# EAGLE schematic homecontroller_main (EAGLE 6.5.0)

## Sheet 1 of 5
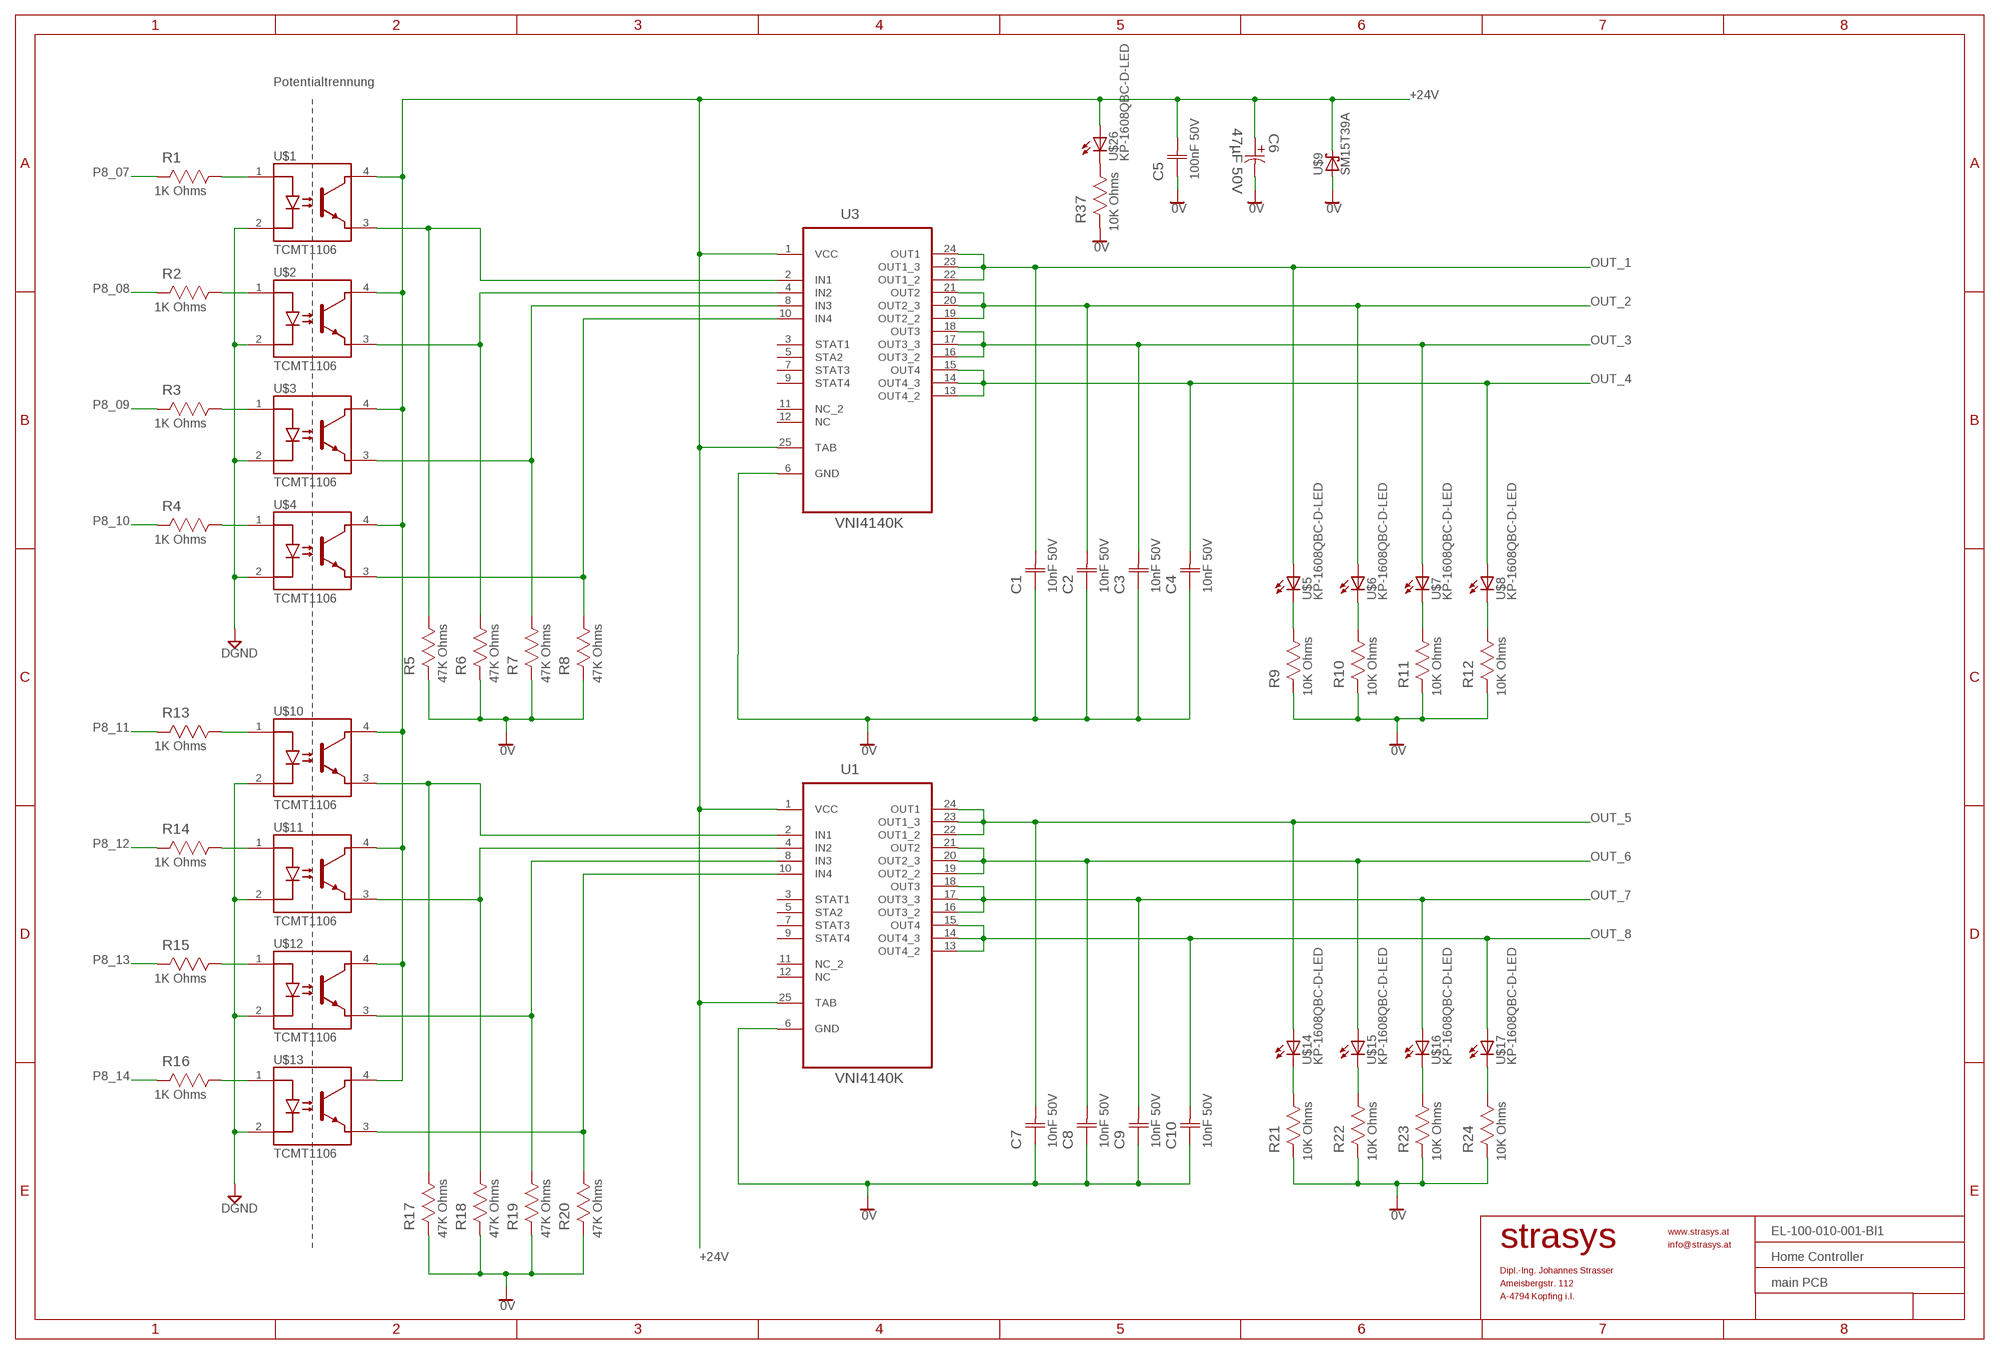
[diagram p0: schematic, sheet 1]

### Parts
C1  10nF 50V  C0603C103K5RACTU  [CAPC1608X85N]
C2  10nF 50V  C0603C103K5RACTU  [CAPC1608X85N]
C3  10nF 50V  C0603C103K5RACTU  [CAPC1608X85N]
C4  10nF 50V  C0603C103K5RACTU  [CAPC1608X85N]
C5  100nF 50V  C0603C104K4RACTU  [CAPC1608X85N]
C6  47µF 50V  EEE-FK1H470P-CASE-E  [CAPAE830X650N]
C7  10nF 50V  C0603C103K5RACTU  [CAPC1608X85N]
C8  10nF 50V  C0603C103K5RACTU  [CAPC1608X85N]
C9  10nF 50V  C0603C103K5RACTU  [CAPC1608X85N]
C10  10nF 50V  C0603C103K5RACTU  [CAPC1608X85N]
R1  1K Ohms  CRCW06031K00FKEA  [RESC1608X60N]
R2  1K Ohms  CRCW06031K00FKEA  [RESC1608X60N]
R3  1K Ohms  CRCW06031K00FKEA  [RESC1608X60N]
R4  1K Ohms  CRCW06031K00FKEA  [RESC1608X60N]
R5  47K Ohms  CRCW060347K0FKEA  [RESC1608X60N]
R6  47K Ohms  CRCW060347K0FKEA  [RESC1608X60N]
R7  47K Ohms  CRCW060347K0FKEA  [RESC1608X60N]
R8  47K Ohms  CRCW060347K0FKEA  [RESC1608X60N]
R9  10K Ohms  CRCW060310K0FKEA  [RESC1608X60N]
R10  10K Ohms  CRCW060310K0FKEA  [RESC1608X60N]
R11  10K Ohms  CRCW060310K0FKEA  [RESC1608X60N]
R12  10K Ohms  CRCW060310K0FKEA  [RESC1608X60N]
R13  1K Ohms  CRCW06031K00FKEA  [RESC1608X60N]
R14  1K Ohms  CRCW06031K00FKEA  [RESC1608X60N]
R15  1K Ohms  CRCW06031K00FKEA  [RESC1608X60N]
R16  1K Ohms  CRCW06031K00FKEA  [RESC1608X60N]
R17  47K Ohms  CRCW060347K0FKEA  [RESC1608X60N]
R18  47K Ohms  CRCW060347K0FKEA  [RESC1608X60N]
R19  47K Ohms  CRCW060347K0FKEA  [RESC1608X60N]
R20  47K Ohms  CRCW060347K0FKEA  [RESC1608X60N]
R21  10K Ohms  CRCW060310K0FKEA  [RESC1608X60N]
R22  10K Ohms  CRCW060310K0FKEA  [RESC1608X60N]
R23  10K Ohms  CRCW060310K0FKEA  [RESC1608X60N]
R24  10K Ohms  CRCW060310K0FKEA  [RESC1608X60N]
R37  10K Ohms  CRCW060310K0FKEA  [RESC1608X60N]
U1  VNI4140K  [SOP80P1030X247-25N]
U3  VNI4140K  [SOP80P1030X247-25N]
U$1  TCMT1106  [SOP-4]
U$2  TCMT1106  [SOP-4]
U$3  TCMT1106  [SOP-4]
U$4  TCMT1106  [SOP-4]
U$5  KP-1608QBC-D-LED  [KP-1608QBCD-D-LED]
U$6  KP-1608QBC-D-LED  [KP-1608QBCD-D-LED]
U$7  KP-1608QBC-D-LED  [KP-1608QBCD-D-LED]
U$8  KP-1608QBC-D-LED  [KP-1608QBCD-D-LED]
U$9  SM15T39A  [SM15T39A]
U$10  TCMT1106  [SOP-4]
U$11  TCMT1106  [SOP-4]
U$12  TCMT1106  [SOP-4]
U$13  TCMT1106  [SOP-4]
U$14  KP-1608QBC-D-LED  [KP-1608QBCD-D-LED]
U$15  KP-1608QBC-D-LED  [KP-1608QBCD-D-LED]
U$16  KP-1608QBC-D-LED  [KP-1608QBCD-D-LED]
U$17  KP-1608QBC-D-LED  [KP-1608QBCD-D-LED]
U$26  KP-1608QBC-D-LED  [KP-1608QBCD-D-LED]

### Nets
0V: C1.1(C1) C2.1(C1) C3.1(C1) C4.1(C1) C5.1(C1) C6.2 C7.1(C1) C8.1(C1) C9.1(C1) C10.1(C1) R5.2 R6.2 R7.2 R8.2 R9.2 R10.2 R11.2 R12.2 R17.2 R18.2 R19.2 R20.2 R21.2 R22.2 R23.2 R24.2 R37.2 U1.6(GND) U3.6(GND) U$9.A ; also sheet 2,5
+24V: C5.2(C2) C6.1 U1.1(VCC) U1.25(TAB) U3.1(VCC) U3.25(TAB) U$1.4 U$2.4 U$3.4 U$4.4 U$9.K(C) U$10.4 U$11.4 U$12.4 U$13.4 U$26.1 ; also sheet 2,5
DGND: U$1.2 U$2.2 U$3.2 U$4.2 U$10.2 U$11.2 U$12.2 U$13.2 ; also sheet 2,3,5
N$1: R1.1 U$1.1
N$2: R2.1 U$2.1
N$3: R3.1 U$3.1
N$4: R4.1 U$4.1
N$5: R5.1 U3.2(IN1) U$1.3
N$6: R6.1 U3.4(IN2) U$2.3
N$7: R7.1 U3.8(IN3) U$3.3
N$8: R8.1 U3.10(IN4) U$4.3
N$9: R13.1 U$10.1
N$10: R9.1 U$5.2
N$11: R10.1 U$6.2
N$12: R11.1 U$7.2
N$13: R12.1 U$8.2
N$14: R14.1 U$11.1
N$15: R15.1 U$12.1
N$16: R16.1 U$13.1
N$17: R17.1 U1.2(IN1) U$10.3
N$18: R18.1 U1.4(IN2) U$11.3
N$19: R19.1 U1.8(IN3) U$12.3
N$20: R20.1 U1.10(IN4) U$13.3
N$21: R21.1 U$14.2
N$22: R22.1 U$15.2
N$23: R23.1 U$16.2
N$24: R24.1 U$17.2
N$37: R37.1 U$26.2
OUT_1: C1.2(C2) U3.22(OUT1_2) U3.23(OUT1_3) U3.24(OUT1) U$5.1 ; also sheet 5
OUT_2: C2.2(C2) U3.19(OUT2_2) U3.20(OUT2_3) U3.21(OUT2) U$6.1 ; also sheet 5
OUT_3: C3.2(C2) U3.16(OUT3_2) U3.17(OUT3_3) U3.18(OUT3) U$7.1 ; also sheet 5
OUT_4: C4.2(C2) U3.13(OUT4_2) U3.14(OUT4_3) U3.15(OUT4) U$8.1 ; also sheet 5
OUT_5: C7.2(C2) U1.22(OUT1_2) U1.23(OUT1_3) U1.24(OUT1) U$14.1 ; also sheet 5
OUT_6: C8.2(C2) U1.19(OUT2_2) U1.20(OUT2_3) U1.21(OUT2) U$15.1 ; also sheet 5
OUT_7: C9.2(C2) U1.16(OUT3_2) U1.17(OUT3_3) U1.18(OUT3) U$16.1 ; also sheet 5
OUT_8: C10.2(C2) U1.13(OUT4_2) U1.14(OUT4_3) U1.15(OUT4) U$17.1 ; also sheet 5
P8_07: R1.2 ; also sheet 5
P8_08: R2.2 ; also sheet 5
P8_09: R3.2 ; also sheet 5
P8_10: R4.2 ; also sheet 5
P8_11: R13.2 ; also sheet 5
P8_12: R14.2 ; also sheet 5
P8_13: R15.2 ; also sheet 5
P8_14: R16.2 ; also sheet 5
Unconnected: U1.3(STAT1) U1.5(STA2) U1.7(STAT3) U1.9(STAT4) U1.11(NC_2) U1.12(NC) U3.3(STAT1) U3.5(STA2) U3.7(STAT3) U3.9(STAT4) U3.11(NC_2) U3.12(NC)

### Notes on the sheet
- Potentialtrennung
- EL-100-010-001-Bl1
- Home Controller
- main PCB

## Sheet 2 of 5
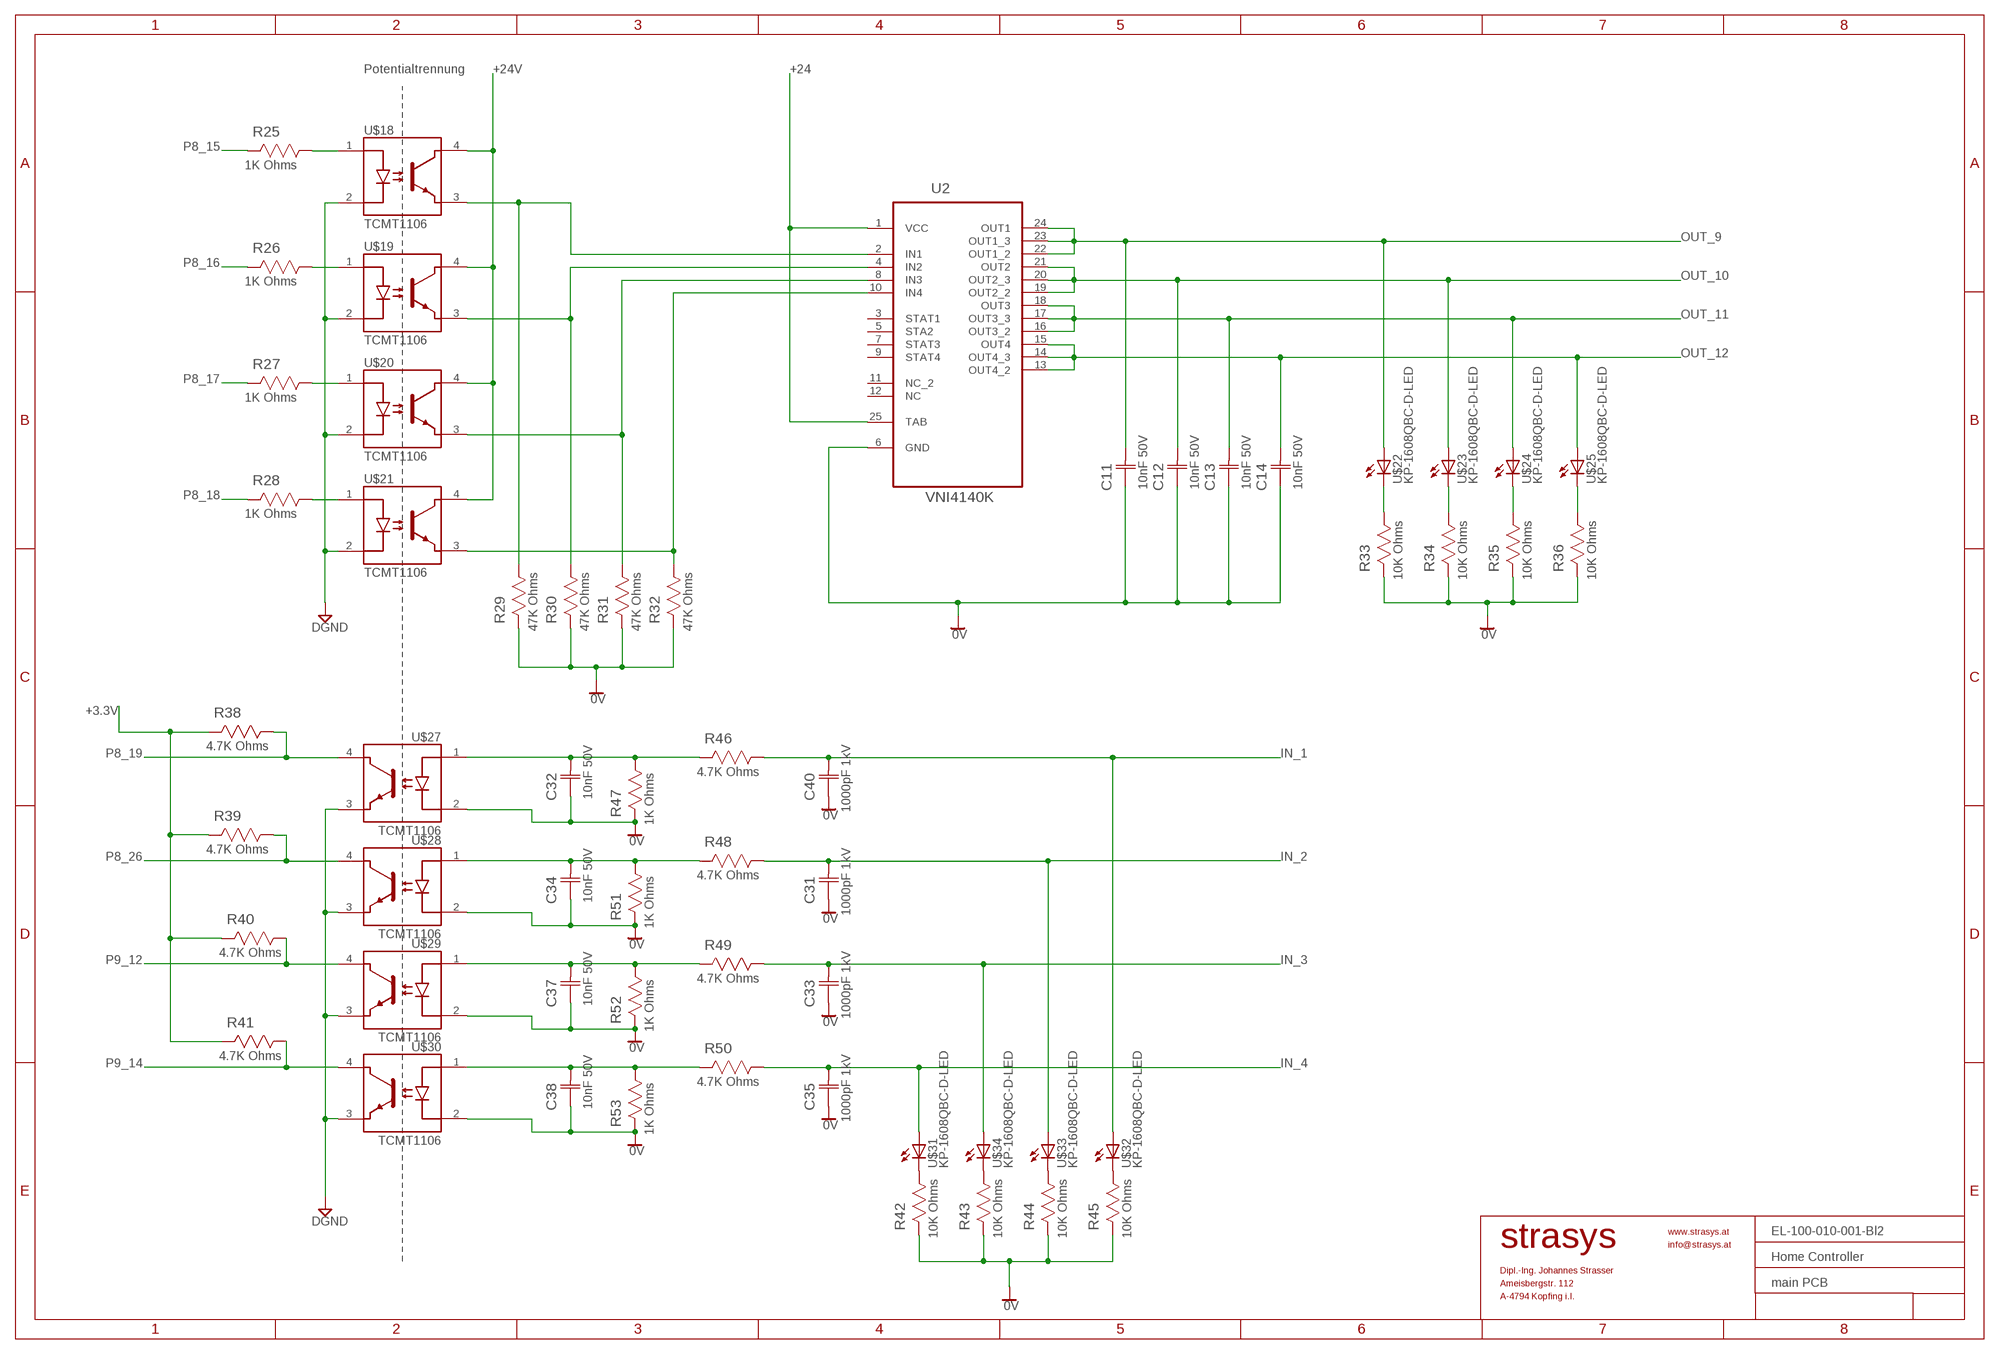
[diagram p1: schematic, sheet 2]

### Parts
C11  10nF 50V  C0603C103K5RACTU  [CAPC1608X85N]
C12  10nF 50V  C0603C103K5RACTU  [CAPC1608X85N]
C13  10nF 50V  C0603C103K5RACTU  [CAPC1608X85N]
C14  10nF 50V  C0603C103K5RACTU  [CAPC1608X85N]
C31  1000pF 1kV  C1206C102KDRACTU  [CAPC3216X88N]
C32  10nF 50V  C0603C103K5RACTU  [CAPC1608X85N]
C33  1000pF 1kV  C1206C102KDRACTU  [CAPC3216X88N]
C34  10nF 50V  C0603C103K5RACTU  [CAPC1608X85N]
C35  1000pF 1kV  C1206C102KDRACTU  [CAPC3216X88N]
C37  10nF 50V  C0603C103K5RACTU  [CAPC1608X85N]
C38  10nF 50V  C0603C103K5RACTU  [CAPC1608X85N]
C40  1000pF 1kV  C1206C102KDRACTU  [CAPC3216X88N]
R25  1K Ohms  CRCW06031K00FKEA  [RESC1608X60N]
R26  1K Ohms  CRCW06031K00FKEA  [RESC1608X60N]
R27  1K Ohms  CRCW06031K00FKEA  [RESC1608X60N]
R28  1K Ohms  CRCW06031K00FKEA  [RESC1608X60N]
R29  47K Ohms  CRCW060347K0FKEA  [RESC1608X60N]
R30  47K Ohms  CRCW060347K0FKEA  [RESC1608X60N]
R31  47K Ohms  CRCW060347K0FKEA  [RESC1608X60N]
R32  47K Ohms  CRCW060347K0FKEA  [RESC1608X60N]
R33  10K Ohms  CRCW060310K0FKEA  [RESC1608X60N]
R34  10K Ohms  CRCW060310K0FKEA  [RESC1608X60N]
R35  10K Ohms  CRCW060310K0FKEA  [RESC1608X60N]
R36  10K Ohms  CRCW060310K0FKEA  [RESC1608X60N]
R38  4.7K Ohms  CRCW06034K70FKEA  [RESC1608X60N]
R39  4.7K Ohms  CRCW06034K70FKEA  [RESC1608X60N]
R40  4.7K Ohms  CRCW06034K70FKEA  [RESC1608X60N]
R41  4.7K Ohms  CRCW06034K70FKEA  [RESC1608X60N]
R42  10K Ohms  CRCW060310K0FKEA  [RESC1608X60N]
R43  10K Ohms  CRCW060310K0FKEA  [RESC1608X60N]
R44  10K Ohms  CRCW060310K0FKEA  [RESC1608X60N]
R45  10K Ohms  CRCW060310K0FKEA  [RESC1608X60N]
R46  4.7K Ohms  CRCW06034K70FKEA  [RESC1608X60N]
R47  1K Ohms  CRCW06031K00FKEA  [RESC1608X60N]
R48  4.7K Ohms  CRCW06034K70FKEA  [RESC1608X60N]
R49  4.7K Ohms  CRCW06034K70FKEA  [RESC1608X60N]
R50  4.7K Ohms  CRCW06034K70FKEA  [RESC1608X60N]
R51  1K Ohms  CRCW06031K00FKEA  [RESC1608X60N]
R52  1K Ohms  CRCW06031K00FKEA  [RESC1608X60N]
R53  1K Ohms  CRCW06031K00FKEA  [RESC1608X60N]
U2  VNI4140K  [SOP80P1030X247-25N]
U$18  TCMT1106  [SOP-4]
U$19  TCMT1106  [SOP-4]
U$20  TCMT1106  [SOP-4]
U$21  TCMT1106  [SOP-4]
U$22  KP-1608QBC-D-LED  [KP-1608QBCD-D-LED]
U$23  KP-1608QBC-D-LED  [KP-1608QBCD-D-LED]
U$24  KP-1608QBC-D-LED  [KP-1608QBCD-D-LED]
U$25  KP-1608QBC-D-LED  [KP-1608QBCD-D-LED]
U$27  TCMT1106  [SOP-4]
U$28  TCMT1106  [SOP-4]
U$29  TCMT1106  [SOP-4]
U$30  TCMT1106  [SOP-4]
U$31  KP-1608QBC-D-LED  [KP-1608QBCD-D-LED]
U$32  KP-1608QBC-D-LED  [KP-1608QBCD-D-LED]
U$33  KP-1608QBC-D-LED  [KP-1608QBCD-D-LED]
U$34  KP-1608QBC-D-LED  [KP-1608QBCD-D-LED]

### Nets
0V: C11.1(C1) C12.1(C1) C13.1(C1) C14.1(C1) C31.1(C1) C32.1(C1) C33.1(C1) C34.1(C1) C35.1(C1) C37.1(C1) C38.1(C1) C40.1(C1) R29.2 R30.2 R31.2 R32.2 R33.2 R34.2 R35.2 R36.2 R42.2 R43.2 R44.2 R45.2 R47.2 R51.2 R52.2 R53.2 U2.6(GND) U$27.2 U$28.2 U$29.2 U$30.2 ; also sheet 1,5
+3.3V: R38.2 R39.2 R40.2 R41.2 ; also sheet 3,5
+24: U2.1(VCC) U2.25(TAB)
+24V: U$18.4 U$19.4 U$20.4 U$21.4 ; also sheet 1,5
DGND: U$18.2 U$19.2 U$20.2 U$21.2 U$27.3 U$28.3 U$29.3 U$30.3 ; also sheet 1,3,5
IN_1: C40.2(C2) R46.1 U$32.1 ; also sheet 5
IN_2: C31.2(C2) R48.1 U$33.1 ; also sheet 5
IN_3: C33.2(C2) R49.1 U$34.1 ; also sheet 5
IN_4: C35.2(C2) R50.1 U$31.1 ; also sheet 5
N$25: R25.1 U$18.1
N$26: R26.1 U$19.1
N$27: R27.1 U$20.1
N$28: R28.1 U$21.1
N$29: R29.1 U2.2(IN1) U$18.3
N$30: R30.1 U2.4(IN2) U$19.3
N$31: R31.1 U2.8(IN3) U$20.3
N$32: R32.1 U2.10(IN4) U$21.3
N$33: R33.1 U$22.2
N$34: R34.1 U$23.2
N$35: R35.1 U$24.2
N$36: R36.1 U$25.2
N$38: R42.1 U$31.2
N$39: R43.1 U$34.2
N$40: R44.1 U$33.2
N$41: R45.1 U$32.2
N$42: C32.2(C2) R46.2 R47.1 U$27.1
N$49: C34.2(C2) R48.2 R51.1 U$28.1
N$50: C37.2(C2) R49.2 R52.1 U$29.1
N$51: C38.2(C2) R50.2 R53.1 U$30.1
OUT_9: C11.2(C2) U2.22(OUT1_2) U2.23(OUT1_3) U2.24(OUT1) U$22.1 ; also sheet 5
OUT_10: C12.2(C2) U2.19(OUT2_2) U2.20(OUT2_3) U2.21(OUT2) U$23.1 ; also sheet 5
OUT_11: C13.2(C2) U2.16(OUT3_2) U2.17(OUT3_3) U2.18(OUT3) U$24.1 ; also sheet 5
OUT_12: C14.2(C2) U2.13(OUT4_2) U2.14(OUT4_3) U2.15(OUT4) U$25.1 ; also sheet 5
P8_15: R25.2 ; also sheet 5
P8_16: R26.2 ; also sheet 5
P8_17: R27.2 ; also sheet 5
P8_18: R28.2 ; also sheet 5
P8_19: R38.1 U$27.4 ; also sheet 5
P8_26: R39.1 U$28.4 ; also sheet 5
P9_12: R40.1 U$29.4 ; also sheet 5
P9_14: R41.1 U$30.4 ; also sheet 5
Unconnected: U2.3(STAT1) U2.5(STA2) U2.7(STAT3) U2.9(STAT4) U2.11(NC_2) U2.12(NC)

### Notes on the sheet
- Potentialtrennung
- EL-100-010-001-Bl2
- Home Controller
- main PCB

## Sheet 3 of 5
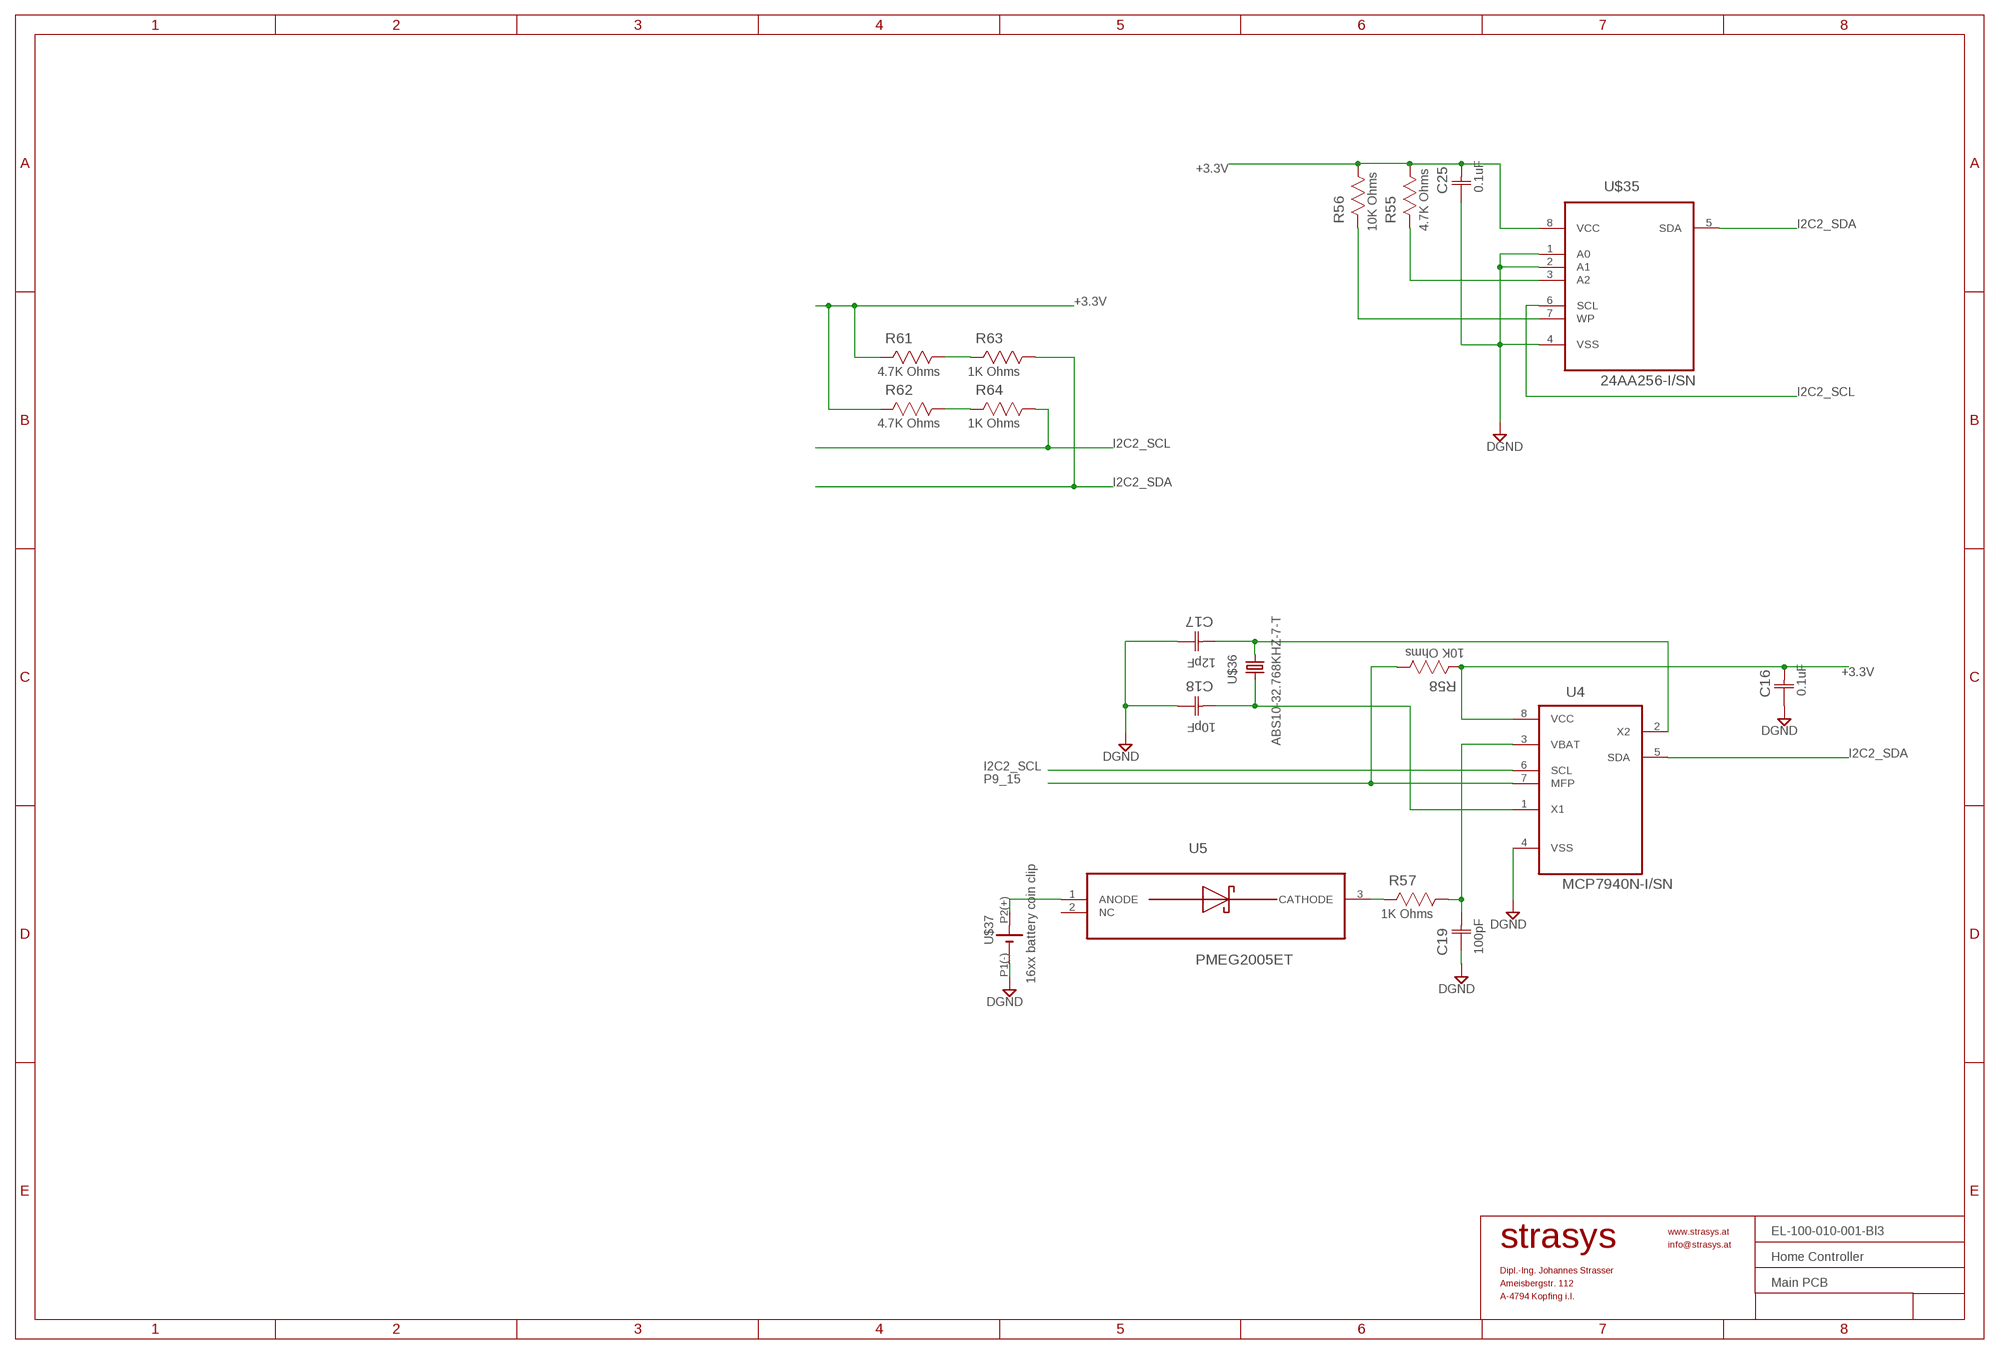
[diagram p2: schematic, sheet 3]

### Parts
C16  0.1uF  C0603C104K5RAC-TU  [CAPC1608X85N]
C17  12pF  C0603C120J5GACTU  [CAPC1608X85N]
C18  10pF  C0603C100J5GACTU  [CAPC1608X85N]
C19  100pF  C0603C101J5GACTU  [CAPC1608X85N]
C25  0.1uF  C0603C104K5RAC-TU  [CAPC1608X85N]
R55  4.7K Ohms  CRCW06034K70FKEA  [RESC1608X60N]
R56  10K Ohms  CRCW060310K0FKEA  [RESC1608X60N]
R57  1K Ohms  CRCW06031K00FKEA  [RESC1608X60N]
R58  10K Ohms  CRCW060310K0FKEA  [RESC1608X60N]
R61  4.7K Ohms  CRCW06034K70FKEA  [RESC1608X60N]
R62  4.7K Ohms  CRCW06034K70FKEA  [RESC1608X60N]
R63  1K Ohms  CRCW06031K00FKEA  [RESC1608X60N]
R64  1K Ohms  CRCW06031K00FKEA  [RESC1608X60N]
U4  MCP7940N-I/SN  [SOIC127P600X175-8N]
U5  PMEG2005ET  [SOT95P280X145-5N]
U$35  24AA256-I/SN  [SOIC127P600X175-8N]
U$36  ABS10-32.768KHZ-7-T  [ABS-10]
U$37  16xx battery coin clip  BATTERY_COIN_CLIP  [BAT_HOLDER_16MM]

### Nets
+3.3V: C16.2(C2) C25.2(C2) R55.1 R56.1 R58.2 R61.2 R62.2 U4.8(VCC) U$35.8(VCC) ; also sheet 2,5
DGND: C16.1(C1) C17.1(C1) C18.1(C1) C19.1(C1) C25.1(C1) U4.4(VSS) U$35.1(A0) U$35.2(A1) U$35.4(VSS) U$37.P1(-)(-) ; also sheet 1,2,5
I2C2_SCL: R64.1 U4.6(SCL) U$35.6(SCL) ; also sheet 5
I2C2_SDA: R63.1 U4.5(SDA) U$35.5(SDA) ; also sheet 5
N$43: R56.2 U$35.7(WP)
N$45: R55.2 U$35.3(A2)
N$46: C17.2(C2) U4.2(X2) U$36.P$1
N$47: R57.2 U5.3(CATHODE)
N$48: C19.2(C2) R57.1 U4.3(VBAT)
N$52: C18.2(C2) U4.1(X1) U$36.P$2
N$53: U5.1(ANODE) U$37.P2(+)(+)
N$59: R61.1 R63.2
N$60: R62.1 R64.2
P9_15: R58.1 U4.7(MFP) ; also sheet 5
Unconnected: U5.2(NC)

### Notes on the sheet
- EL-100-010-001-Bl3
- Home Controller
- Main PCB

## Sheet 4 of 5
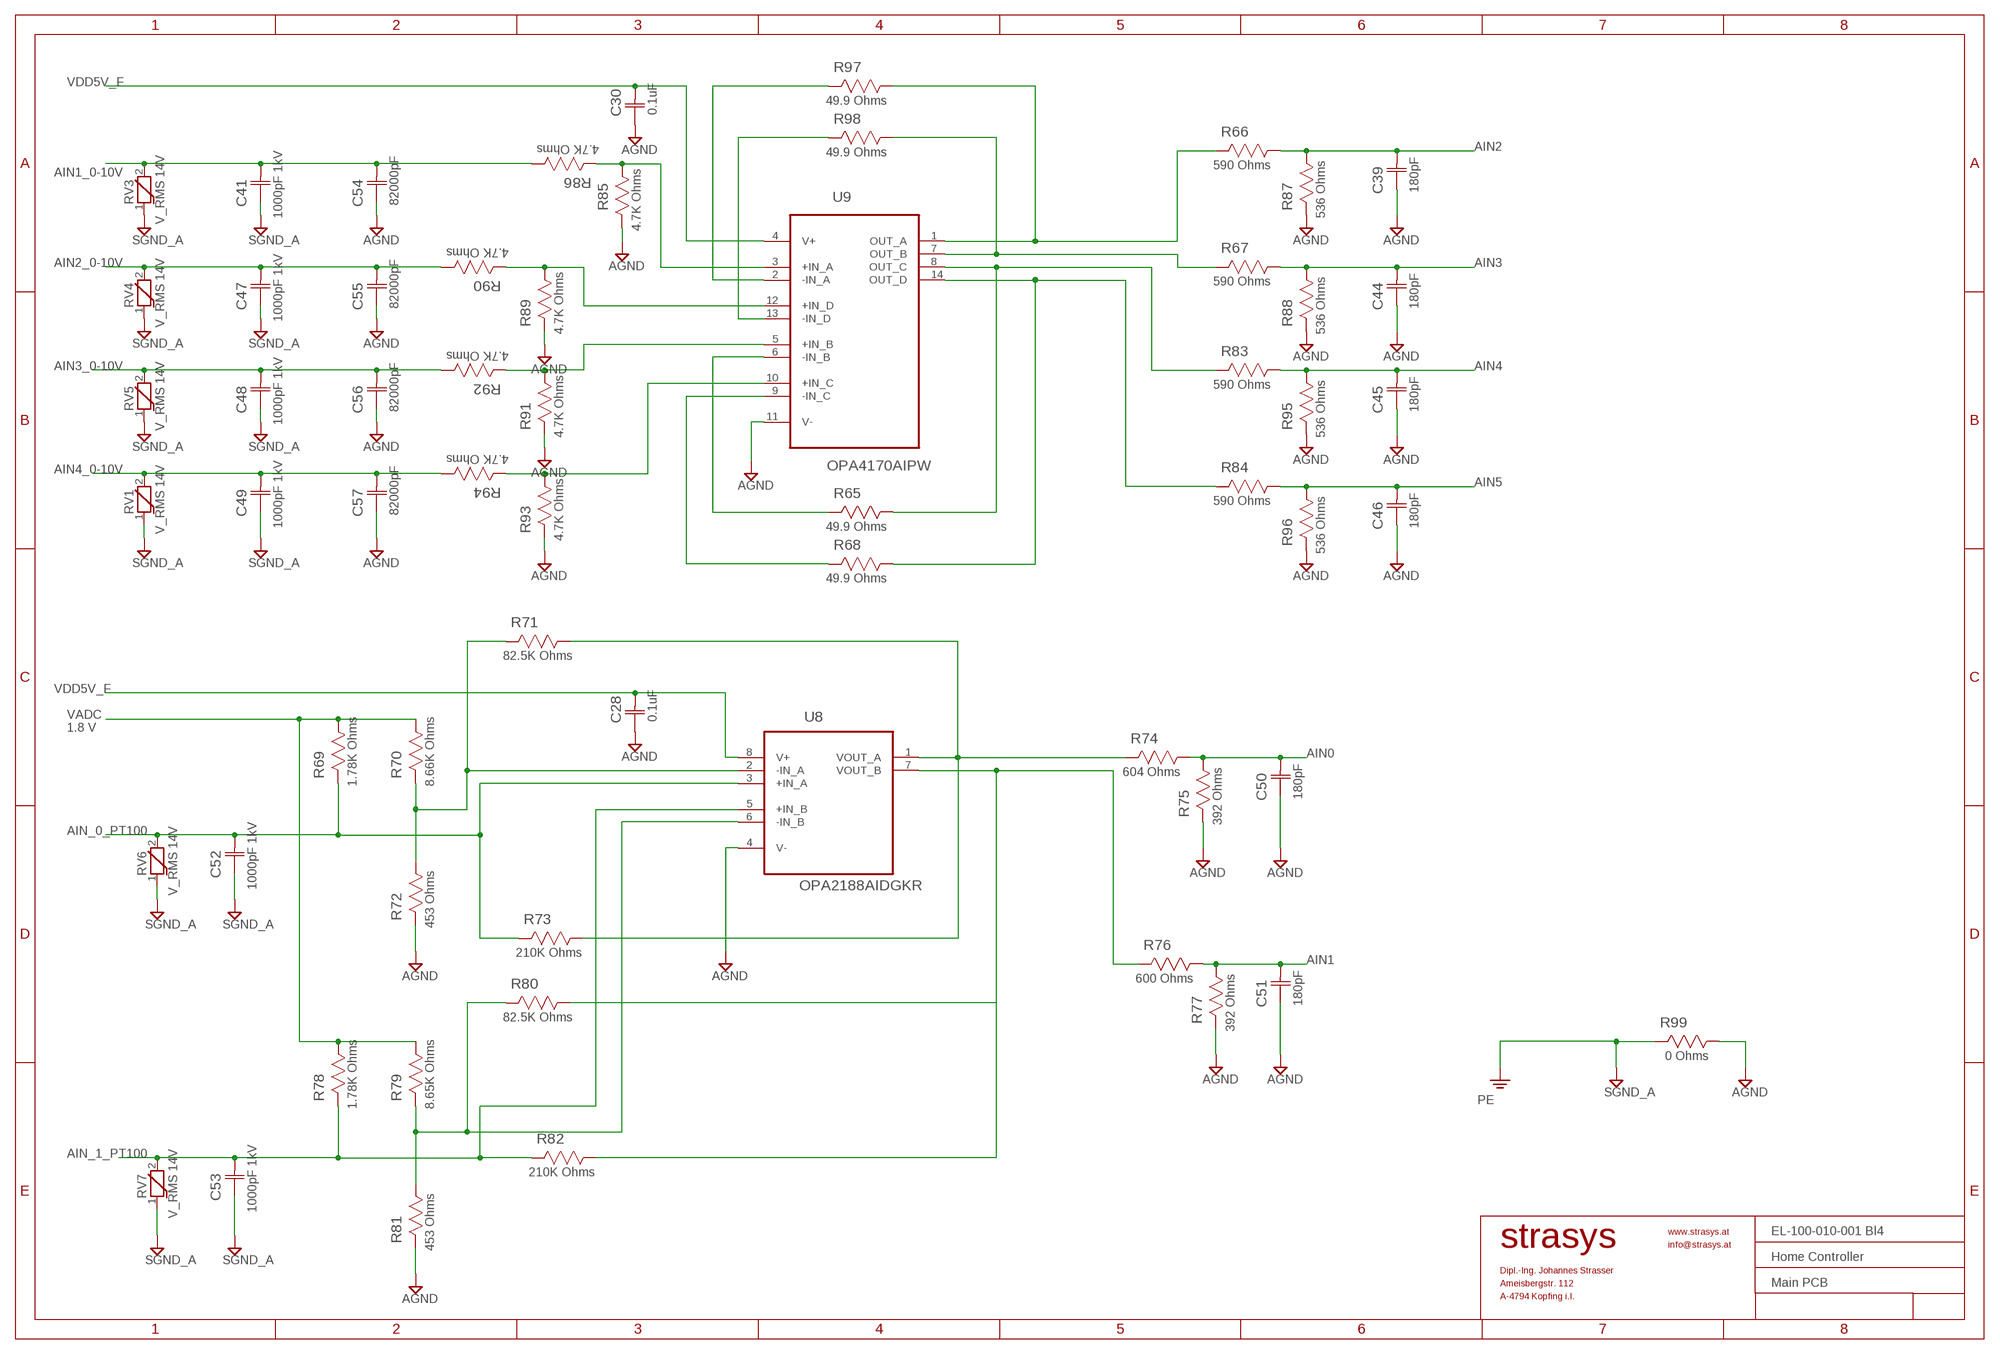
[diagram p3: schematic, sheet 4]

### Parts
C28  0.1uF  C0603C104K5RAC-TU  [CAPC1608X85N]
C30  0.1uF  C0603C104K5RAC-TU  [CAPC1608X85N]
C39  180pF  C0603C181J2GACTU  [CAPC1608X85N]
C41  1000pF 1kV  C1206C102KDRACTU  [CAPC3216X88N]
C44  180pF  C0603C181J2GACTU  [CAPC1608X85N]
C45  180pF  C0603C181J2GACTU  [CAPC1608X85N]
C46  180pF  C0603C181J2GACTU  [CAPC1608X85N]
C47  1000pF 1kV  C1206C102KDRACTU  [CAPC3216X88N]
C48  1000pF 1kV  C1206C102KDRACTU  [CAPC3216X88N]
C49  1000pF 1kV  C1206C102KDRACTU  [CAPC3216X88N]
C50  180pF  C0603C181J2GACTU  [CAPC1608X85N]
C51  180pF  C0603C181J2GACTU  [CAPC1608X85N]
C52  1000pF 1kV  C1206C102KDRACTU  [CAPC3216X88N]
C53  1000pF 1kV  C1206C102KDRACTU  [CAPC3216X88N]
C54  82000pF  C0603C823K5RACTU  [CAPC1608X85N]
C55  82000pF  C0603C823K5RACTU  [CAPC1608X85N]
C56  82000pF  C0603C823K5RACTU  [CAPC1608X85N]
C57  82000pF  C0603C823K5RACTU  [CAPC1608X85N]
R65  49.9 Ohms  CRCW060349R9FKEA  [RESC1608X60N]
R66  590 Ohms  CRCW0603590RFKEA  [RESC1608X60N]
R67  590 Ohms  CRCW0603590RFKEA  [RESC1608X60N]
R68  49.9 Ohms  CRCW060349R9FKEA  [RESC1608X60N]
R69  1.78K Ohms  CRCW06031K78FKEA  [RESC1608X60N]
R70  8.66K Ohms  CRCW06038K66FKEA  [RESC1608X60N]
R71  82.5K Ohms  CRCW060382K5FKEA  [RESC1608X60N]
R72  453 Ohms  CRCW0603453RFKEA  [RESC1608X60N]
R73  210K Ohms  CRCW0603210KFKEA  [RESC1608X60N]
R74  604 Ohms  CRCW0603604RFKEA  [RESC1608X60N]
R75  392 Ohms  CRCW0603392RFKEA  [RESC1608X60N]
R76  600 Ohms  CRCW06036K04FKEA  [RESC1608X60N]
R77  392 Ohms  CRCW06036K04FKEA  [RESC1608X60N]
R78  1.78K Ohms  CRCW06031K78FKEA  [RESC1608X60N]
R79  8.65K Ohms  CRCW06038K66FKEA  [RESC1608X60N]
R80  82.5K Ohms  CRCW060382K5FKEA  [RESC1608X60N]
R81  453 Ohms  CRCW0603453RFKEA  [RESC1608X60N]
R82  210K Ohms  CRCW0603210KFKEA  [RESC1608X60N]
R83  590 Ohms  CRCW0603590RFKEA  [RESC1608X60N]
R84  590 Ohms  CRCW0603590RFKEA  [RESC1608X60N]
R85  4.7K Ohms  CRCW06034K70FKEA  [RESC1608X60N]
R86  4.7K Ohms  CRCW06034K70FKEA  [RESC1608X60N]
R87  536 Ohms  CRCW0603536RFKEA  [RESC1608X60N]
R88  536 Ohms  CRCW0603536RFKEA  [RESC1608X60N]
R89  4.7K Ohms  CRCW06034K70FKEA  [RESC1608X60N]
R90  4.7K Ohms  CRCW06034K70FKEA  [RESC1608X60N]
R91  4.7K Ohms  CRCW06034K70FKEA  [RESC1608X60N]
R92  4.7K Ohms  CRCW06034K70FKEA  [RESC1608X60N]
R93  4.7K Ohms  CRCW06034K70FKEA  [RESC1608X60N]
R94  4.7K Ohms  CRCW06034K70FKEA  [RESC1608X60N]
R95  536 Ohms  CRCW0603536RFKEA  [RESC1608X60N]
R96  536 Ohms  CRCW0603536RFKEA  [RESC1608X60N]
R97  49.9 Ohms  CRCW060349R9FKEA  [RESC1608X60N]
R98  49.9 Ohms  CRCW060349R9FKEA  [RESC1608X60N]
R99  0 Ohms  CRCW06030000Z0EA  [RESC1608X60N]
RV1  V_RMS 14V  WE-VS-82536140_0603  [WESURGE_0603]
RV3  V_RMS 14V  WE-VS-82536140_0603  [WESURGE_0603]
RV4  V_RMS 14V  WE-VS-82536140_0603  [WESURGE_0603]
RV5  V_RMS 14V  WE-VS-82536140_0603  [WESURGE_0603]
RV6  V_RMS 14V  WE-VS-82536140_0603  [WESURGE_0603]
RV7  V_RMS 14V  WE-VS-82536140_0603  [WESURGE_0603]
U8  OPA2188AIDGKR  [SOP65P490X110-8N]
U9  OPA4170AIPW  [SOP65P640X120-14N]

### Nets
AGND: C28.1(C1) C30.1(C1) C39.1(C1) C44.1(C1) C45.1(C1) C46.1(C1) C50.1(C1) C51.1(C1) C54.1(C1) C55.1(C1) C56.1(C1) C57.1(C1) R72.2 R75.2 R77.2 R81.2 R85.2 R87.2 R88.2 R89.2 R91.2 R93.2 R95.2 R96.2 R99.1 U8.4(V-) U9.11(V-) ; also sheet 5
AIN0: C50.2(C2) R74.1 R75.1 ; also sheet 5
AIN1: C51.2(C2) R76.1 R77.1 ; also sheet 5
AIN1_0-10V: C41.2(C2) C54.2(C2) R86.1 RV3.2 ; also sheet 5
AIN2: C39.2(C2) R66.1 R87.1 ; also sheet 5
AIN2_0-10V: C47.2(C2) C55.2(C2) R90.1 RV4.2 ; also sheet 5
AIN3: C44.2(C2) R67.1 R88.1 ; also sheet 5
AIN3_0-10V: C48.2(C2) C56.2(C2) R92.1 RV5.2 ; also sheet 5
AIN4: C45.2(C2) R83.1 R95.1 ; also sheet 5
AIN4_0-10V: C49.2(C2) C57.2(C2) R94.1 RV1.2 ; also sheet 5
AIN5: C46.2(C2) R84.1 R96.1 ; also sheet 5
AIN_0_PT100: C52.2(C2) R69.2 R73.2 RV6.2 U8.3(+IN_A) ; also sheet 5
AIN_1_PT100: C53.2(C2) R78.2 R82.2 RV7.2 U8.5(+IN_B) ; also sheet 5
GND2: C41.1(C1) C47.1(C1) C48.1(C1) C49.1(C1) C52.1(C1) C53.1(C1) R99.2 RV1.1 RV3.1 RV4.1 RV5.1 RV6.1 RV7.1 ; supply symbol labelled PE, SGND_A
N$62: R66.2 R97.1 U9.1(OUT_A)
N$64: R65.2 U9.6(-IN_B)
N$65: R71.1 R73.1 R74.2 U8.1(VOUT_A)
N$66: R67.2 R98.1 U9.7(OUT_B)
N$67: R76.2 R80.1 R82.1 U8.7(VOUT_B)
N$68: R79.2 R80.2 R81.1 U8.6(-IN_B)
N$69: R70.2 R71.2 R72.1 U8.2(-IN_A)
N$70: R65.1 R83.2 U9.8(OUT_C)
N$71: R68.1 R84.2 U9.14(OUT_D)
N$72: R97.2 U9.2(-IN_A)
N$73: R89.1 R90.2 U9.12(+IN_D)
N$74: R91.1 R92.2 U9.5(+IN_B)
N$75: R93.1 R94.2 U9.10(+IN_C)
N$76: R98.2 U9.13(-IN_D)
N$77: R85.1 R86.2 U9.3(+IN_A)
N$79: R68.2 U9.9(-IN_C)
VADC: R69.1 R70.1 R78.1 R79.1 ; also sheet 5
VDD5V_F: C28.2(C2) C30.2(C2) U8.8(V+) U9.4(V+) ; also sheet 5

### Notes on the sheet
- 1.8 V
- EL-100-010-001 Bl4
- Home Controller
- Main PCB

## Sheet 5 of 5
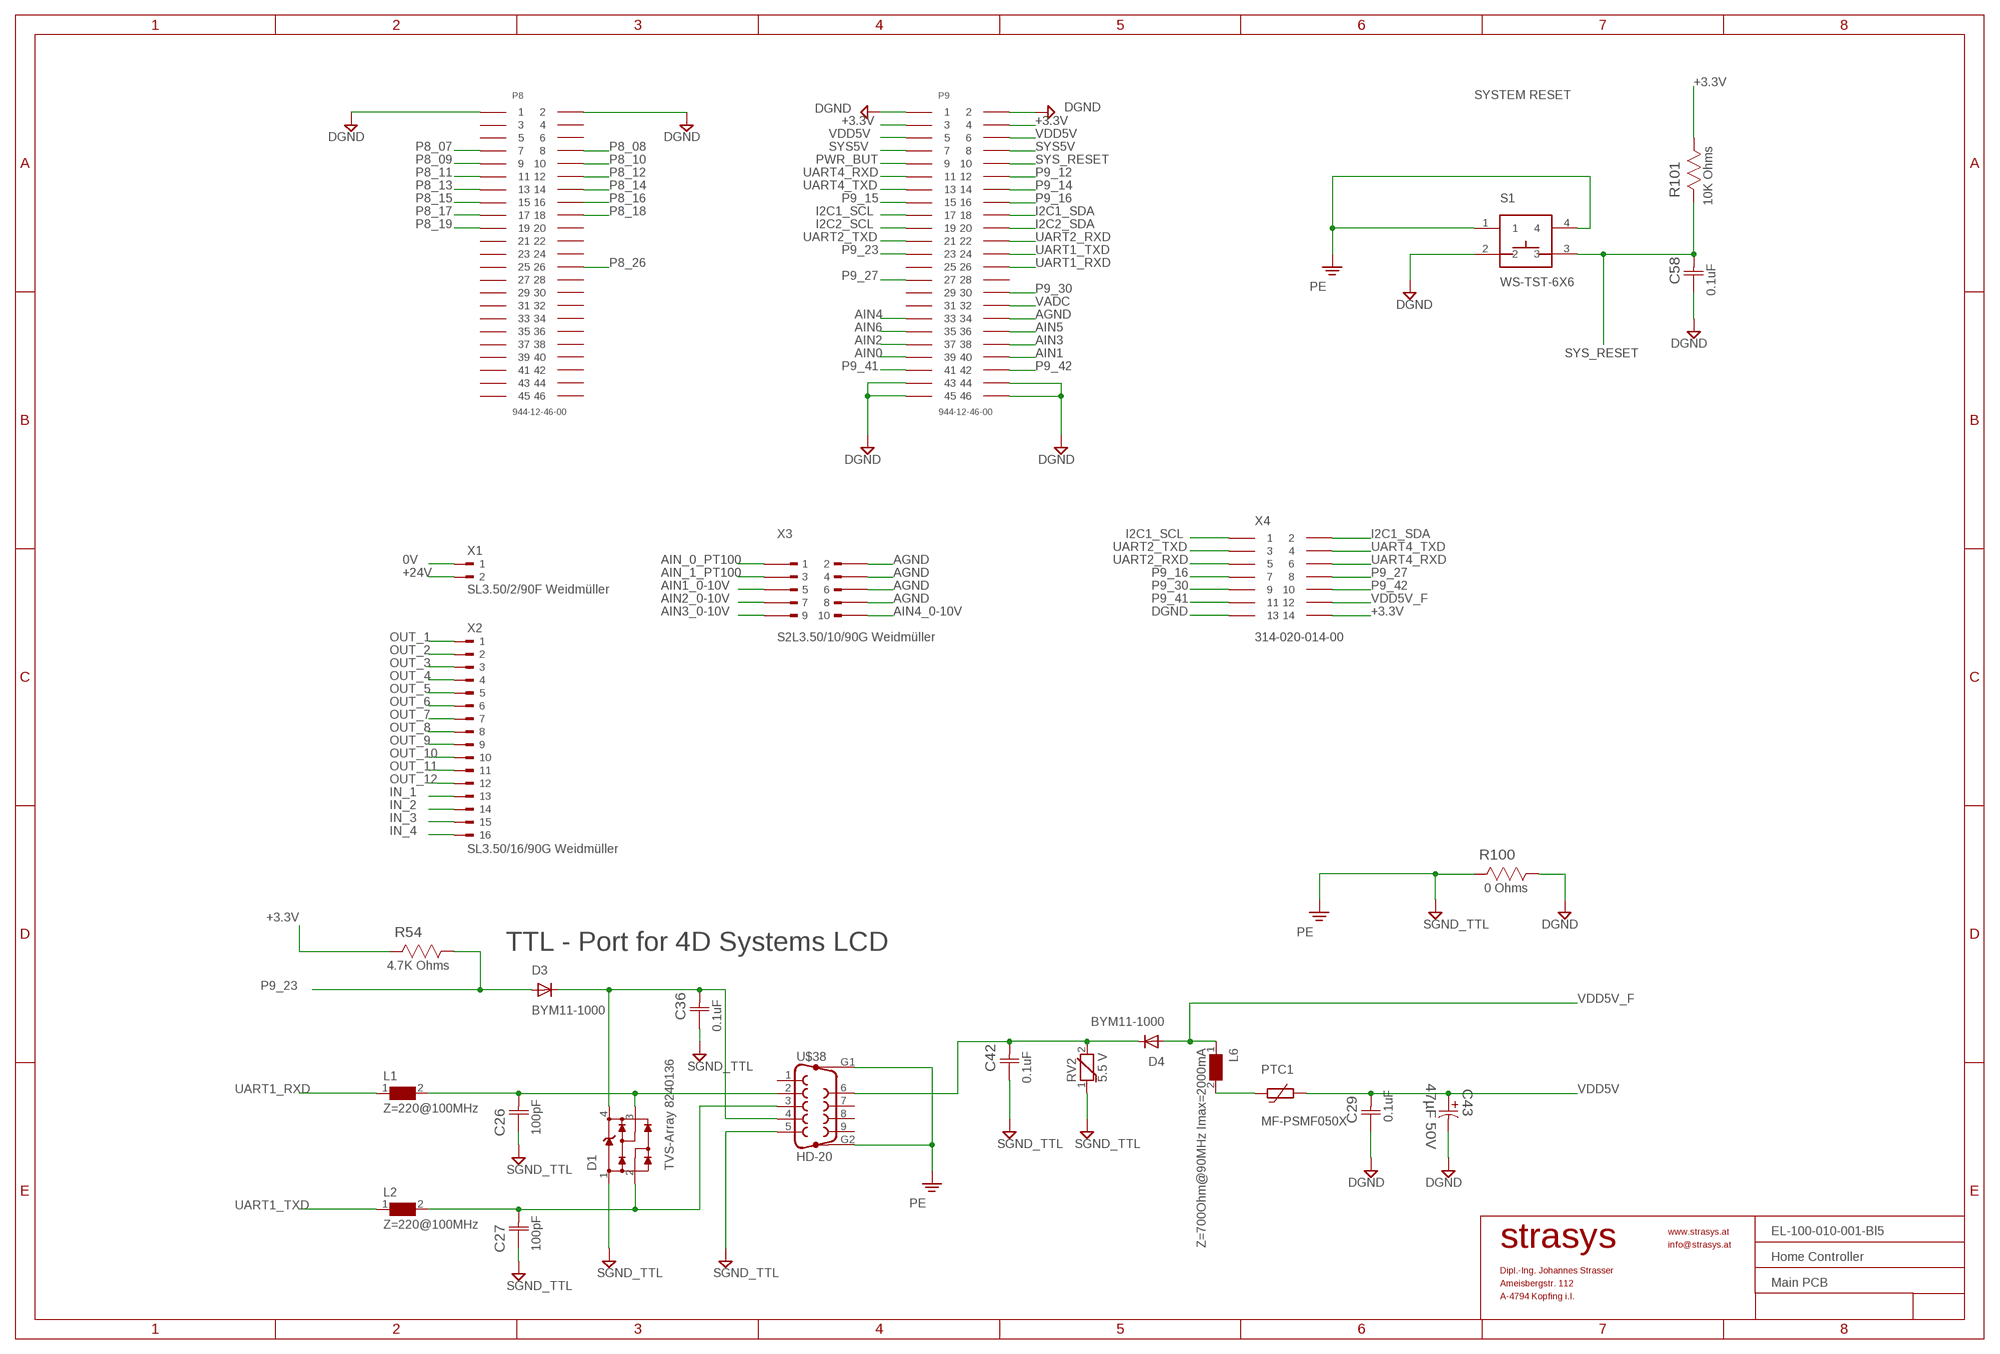
[diagram p4: schematic, sheet 5]

### Parts
C26  100pF  C0603C101J5GACTU  [CAPC1608X85N]
C27  100pF  C0603C101J5GACTU  [CAPC1608X85N]
C29  0.1uF  C0603C104K5RAC-TU  [CAPC1608X85N]
C36  0.1uF  C0603C104K5RAC-TU  [CAPC1608X85N]
C42  0.1uF  C0603C104K5RAC-TU  [CAPC1608X85N]
C43  47µF 50V  EEE-FK1H470P-CASE-E  [CAPAE830X650N]
C58  0.1uF  C0603C104K5RAC-TU  [CAPC1608X85N]
D1  TVS-Array 8240136  WE-TVS_8240136  [WE-TVS_SOT143-4L]
D3  BYM11-1000  [DO-213AB]
D4  BYM11-1000  [DO-213AB]
L1  Z=220@100MHz  WE-CBF-74279263_0603  [0603]
L2  Z=220@100MHz  WE-CBF-74279263_0603  [0603]
L6  Z=700Ohm@90MHz Imax=2000mA  WE-CBF-74279218_1206  [1206]
P8  944-12-46-00  [2,54_STIFTLEIST_2X23]
P9  944-12-46-00  [2,54_STIFTLEIST_2X23]
PTC1  MF-PSMF050X  [MF-PSMF]
R54  4.7K Ohms  CRCW06034K70FKEA  [RESC1608X60N]
R100  0 Ohms  CRCW06030000Z0EA  [RESC1608X60N]
R101  10K Ohms  CRCW060310K0FKEA  [RESC1608X60N]
RV2  5.5 V  WE-VS-82536040_0603  [WESURGE_0603]
S1  WS-TST-6X6  [WS-TST_6X6_RIGHTANGL_SWITCH]
U$38  HD-20  [SUB-D_HD-20]
X1  SL3.50/2/90F Weidmüller  90F-2  [90F-2]
X2  SL3.50/16/90G Weidmüller  90G-16  [90G-16]
X3  S2L3.50/10/90G Weidmüller  S2L3.50/10/90G  [S2L-90G-10]
X4  314-020-014-00  [2,00_STIFTLEISTE_2X7]

### Nets
0V: X1.1 ; also sheet 1,2
+3.3V: P9.3 P9.4 R54.2 R101.1 X4.14 ; also sheet 2,3
+24V: X1.2 ; also sheet 1,2
AGND: P9.34 X3.P2 X3.P4 X3.P6 X3.P8 ; also sheet 4
AIN0: P9.39 ; also sheet 4
AIN1: P9.40 ; also sheet 4
AIN1_0-10V: X3.P5 ; also sheet 4
AIN2: P9.37 ; also sheet 4
AIN2_0-10V: X3.P7 ; also sheet 4
AIN3: P9.38 ; also sheet 4
AIN3_0-10V: X3.P9 ; also sheet 4
AIN4: P9.33 ; also sheet 4
AIN4_0-10V: X3.P10 ; also sheet 4
AIN5: P9.36 ; also sheet 4
AIN6: P9.35
AIN_0_PT100: X3.P1 ; also sheet 4
AIN_1_PT100: X3.P3 ; also sheet 4
DGND: C29.1(C1) C43.2 C58.1(C1) P8.1 P8.2 P9.1 P9.2 P9.43 P9.44 P9.45 P9.46 R100.1 S1.2 X4.13 ; also sheet 1,2,3
I2C1_SCL: P9.17 X4.1
I2C1_SDA: P9.18 X4.2
I2C2_SCL: P9.19 ; also sheet 3
I2C2_SDA: P9.20 ; also sheet 3
IN_1: X2.13 ; also sheet 2
IN_2: X2.14 ; also sheet 2
IN_3: X2.15 ; also sheet 2
IN_4: X2.16 ; also sheet 2
N$61: L6.2 PTC1.P$1
N$63: C36.2(C2) D1.4(VDD) D3.C U$38.4
OUT_1: X2.1 ; also sheet 1
OUT_2: X2.2 ; also sheet 1
OUT_3: X2.3 ; also sheet 1
OUT_4: X2.4 ; also sheet 1
OUT_5: X2.5 ; also sheet 1
OUT_6: X2.6 ; also sheet 1
OUT_7: X2.7 ; also sheet 1
OUT_8: X2.8 ; also sheet 1
OUT_9: X2.9 ; also sheet 2
OUT_10: X2.10 ; also sheet 2
OUT_11: X2.11 ; also sheet 2
OUT_12: X2.12 ; also sheet 2
P8_07: P8.7 ; also sheet 1
P8_08: P8.8 ; also sheet 1
P8_09: P8.9 ; also sheet 1
P8_10: P8.10 ; also sheet 1
P8_11: P8.11 ; also sheet 1
P8_12: P8.12 ; also sheet 1
P8_13: P8.13 ; also sheet 1
P8_14: P8.14 ; also sheet 1
P8_15: P8.15 ; also sheet 2
P8_16: P8.16 ; also sheet 2
P8_17: P8.17 ; also sheet 2
P8_18: P8.18 ; also sheet 2
P8_19: P8.19 ; also sheet 2
P8_26: P8.26 ; also sheet 2
P9_12: P9.12 ; also sheet 2
P9_14: P9.14 ; also sheet 2
P9_15: P9.15 ; also sheet 3
P9_16: P9.16 X4.7
P9_23: D3.A P9.23 R54.1
P9_27: P9.27 X4.8
P9_30: P9.30 X4.9
P9_41: P9.41 X4.11
P9_42: P9.42 X4.10
PE: R100.2 S1.1 S1.4 U$38.G1 U$38.G2 ; supply symbol labelled SGND_TTL
PWR_BUT: P9.9
SGND_TTL: C26.1(C1) C27.1(C1) C36.1(C1) C42.1(C1) D1.1(GND) RV2.1 U$38.5
SYS5V: P9.7 P9.8
SYS_RESET: C58.2(C2) P9.10 R101.2 S1.3
UART1_RXD: C26.2(C2) D1.3 L1.1 L1.2 P9.26 U$38.2
UART1_TXD: C27.2(C2) D1.2 L2.1 L2.2 P9.24 U$38.3
UART2_RXD: P9.22 X4.5
UART2_TXD: P9.21 X4.3
UART4_RXD: P9.11 X4.6
UART4_TXD: P9.13 X4.4
VADC: P9.32 ; also sheet 4
VDD5V: C29.2(C2) C43.1 P9.5 P9.6 PTC1.P$2
VDD5V_F: D4.A L6.1 X4.12 ; also sheet 4
VDD5V_OUT: C42.2(C2) D4.C RV2.2 U$38.6
Unconnected: P8.3 P8.4 P8.5 P8.6 P8.20 P8.21 P8.22 P8.23 P8.24 P8.25 P8.27 P8.28 P8.29 P8.30 P8.31 P8.32 P8.33 P8.34 P8.35 P8.36 P8.37 P8.38 P8.39 P8.40 P8.41 P8.42 P8.43 P8.44 P8.45 P8.46 P9.25 P9.28 P9.29 P9.31 U$38.1 U$38.7 U$38.8 U$38.9

### Notes on the sheet
- SYSTEM RESET
- TTL - Port for 4D Systems LCD
- EL-100-010-001-Bl5
- Home Controller
- Main PCB

## Library data of the parts
C1-C4 C7-C14 C32 C34 C37 C38 = Kemet_By_element14_Batch_1:C0603C103K5RACTU: CAPACITOR, 0603; MPN: C0603C103K5RACTU; OC_FARNELL: 1414609; OC_NEWARK: 30C5334; SUPPLIER: Kemet; TOLERANCE: ±10%; VALUE: 10nF; VOLTAGERATING: 50V
C5 = Kemet_By_element14_Batch_1:C0603C104K4RACTU: CAPACITOR, 0603; MPN: C0603C104K5RACTU; OC_FARNELL: 1288255; SUPPLIER: Kemet; TOLERANCE: ±10%; VALUE: 100nF; VOLTAGERATING: 50V
C6 C43 = strasys_standard:EEE-: Aluminum Electrolytic Capacitors,Surface Mount Type; MPN: EEE-FK1H470P; OC_FARNELL: 9695931; OC_NEWARK: 96K9397; PACKAGE: CASE-E; SUPPLIER: PANASONIC; TOLERANCE: ±20 %; VALUE: 47UF; VOLTAGERATING: 50V
C16 C25 C28-C30 C36 C42 C58 = Kemet_By_element14_Batch_1:C0603C104K5RAC-TU: CAPACITOR, 0603; MPN: C0603C104K5RAC-TU; OC_FARNELL: 1692286; OC_NEWARK: 97H5226; SUPPLIER: Kemet; TOLERANCE: ±10%; VOLTAGERATING: 50V
C17 = Kemet_By_element14_Batch_1:C0603C120J5GACTU: CAPACITOR, 0603; MPN: C0603C120J5GACTU; OC_FARNELL: 1414612; OC_NEWARK: 19C1214; SUPPLIER: Kemet; TOLERANCE: ±5%; VOLTAGERATING: 50V
C18 = Kemet_By_element14_Batch_1:C0603C100J5GACTU: CAPACITOR, 0603; MPN: C0603C100J5GACTU; OC_FARNELL: 1414601; OC_NEWARK: 64K2831; SUPPLIER: Kemet; TOLERANCE: ±5%; VOLTAGERATING: 50V
C19 C26 C27 = Kemet_By_element14_Batch_1:C0603C101J5GACTU: CAPACITOR, 0603; MPN: C0603C101J5GACTU; OC_FARNELL: 1414603; OC_NEWARK: 64K2833; SUPPLIER: Kemet; TOLERANCE: ±5%; VOLTAGERATING: 50V
C31 C33 C35 C40 C41 C47-C49 C52 C53 = supply2:C1206C102KDRACTU: Capacitor 1206; MPN: C1206C102KDRACTU; OC_FARNELL: 1826304; SUPPLIER: Kemet; TOLERANCE: +/- 10%; VALUE: 1000pF; VOLTAGE_RATING: 1000V
C39 C44-C46 C50 C51 = Kemet_By_element14_Batch_1:C0603C181J2GACTU: CAPACITOR, 0603; MPN: C0603C181J2GACTU; OC_FARNELL: 1865524; OC_NEWARK: 29T8996; SUPPLIER: KEMET; TOLERANCE: ±5%; VOLTAGERATING: 200V
C54-C57 = Kemet_By_element14_Batch_1:C0603C823K5RACTU: CAPACITOR, 0603; MPN: C0603C823K5RACTU; OC_FARNELL: 1865539; OC_NEWARK: 29T9054; SUPPLIER: KEMET; TOLERANCE: ±10%; VOLTAGERATING: 50V
D1 = WE-TVS_8240136:WE-TVS_8240136: TVS Diode Array WE-TVS, High Speed Series - Low capazity - No leakage current - Low clamping voltage - high ESD voltage protection -- 3.3 VDC Application; MPN: 8240136; OC_FARNELL: 1825870; OC_NEWARK: 79R6951; PACKAGE: SOT143-4L; SUPPLIER: Wuerth Elektronik
D3 D4 = strasys_standard:BYM11: BYM11 Switching Rectifier Vishay; MPN: BYM11-1000-E3/96; OC_FARNELL: 1336518; PACKAGE: DO-213AB; SUPPLIER: Vishay
L1 L2 = WE-CBF:WE-CBF: SMD EMI Suppression Ferrite Beads WE-CBF - Excellent anti-EMI properties - Low DC-restistance - Impedances till 3000 ohms - Rated current up to 6 A -- Reliable Ni-Sn electrodes -- Perfect as data lined filter and for uncoupling of distribution voltage; MPN: 74279263; OC_FARNELL: 1635689; OC_NEWARK: 08P2434; PACKAGE: IND-0603; SUPPLIER: Wuerth Elektronik
L6 = WE-CBF:WE-CBF: SMD EMI Suppression Ferrite Beads WE-CBF - Excellent anti-EMI properties - Low DC-restistance - Impedances till 3000 ohms - Rated current up to 6 A -- Reliable Ni-Sn electrodes -- Perfect as data lined filter and for uncoupling of distribution voltage; MPN: 74279218; OC_FARNELL: 1635758; OC_NEWARK: 08P2403; PACKAGE: IND-1206; SUPPLIER: Wuerth Elektronik
P8 P9 = strasys_standard:944-12-46-00: 2.54 mm 2 - reihiger male connector; MPN: 944-12-46-00; SUPPLIER: W+P
PTC1 = strasys_standard:MF-PSMF: MF-PSMF Series PTC resetable Fuses Manufacturer Bourns Size: 0805; HOLD_CURRENT: 500 mA; MPN: MF-PSMF050X-2; OC_FARNELL: 1294876; PACKAGE: 0805; SUPPLIER: Bourns
R1-R4 R13-R16 R25-R28 R47 R51-R53 R57 R63 R64 = Vishay_By_element14_Batch_1:CRCW06031K00FKEA: RESISTOR, 0603; MPN: CRCW06031K00FKEA; OC_FARNELL: 1469740; OC_NEWARK: 52K8015; SUPPLIER: Vishay; TOLERANCE: ± 1.0 %; WATTAGE: 0.1W
R5-R8 R17-R20 R29-R32 = Vishay_By_element14_Batch_1:CRCW060347K0FKEA: RESISTOR, 0603; MPN: CRCW060347K0FKEA; OC_FARNELL: 1469811; OC_NEWARK: 52K8548; SUPPLIER: Vishay; TOLERANCE: ± 1.0 %; WATTAGE: 0.1W
R9-R12 R21-R24 R33-R37 R42-R45 R56 R58 R101 = Vishay_By_element14_Batch_1:CRCW060310K0FKEA: RESISTOR, 0603; MPN: CRCW060310K0FKEA; OC_FARNELL: 1469748; OC_NEWARK: 52K8062; SUPPLIER: Vishay; TOLERANCE: ± 1.0 %; WATTAGE: 0.1W
R38-R41 R46 R48-R50 R54 R55 R61 R62 R85 R86 R89-R94 = Vishay_By_element14_Batch_1:CRCW06034K70FKEA: RESISTOR, 0603; MPN: CRCW06034K70FKEA; OC_FARNELL: 1469807; OC_NEWARK: 52K8494; SUPPLIER: Vishay; TOLERANCE: ± 1.0 %; WATTAGE: 0.1W
R65 R68 R97 R98 = Vishay_By_element14_Batch_1:CRCW060349R9FKEA: RESISTOR, 0603; MPN: CRCW060349R9FKEA; OC_FARNELL: 1469817; OC_NEWARK: 52K8566; SUPPLIER: Vishay; TOLERANCE: ± 1.0 %; WATTAGE: 0.1W
R66 R67 R83 R84 = Vishay_By_element14_Batch_1:CRCW0603590RFKEA: RESISTOR, 0603; MPN: CRCW0603590RFKEA; OC_FARNELL: 1364711; OC_NEWARK: 52K8633; SUPPLIER: VISHAY DALE ELECTRONICS; TOLERANCE: ±1%; WATTAGE: 0.1 W
R69 R78 = Vishay_By_element14_Batch_1:CRCW06031K78FKEA: RESISTOR, 0603; MPN: CRCW06031K78FKEA; OC_FARNELL: 1157174; OC_NEWARK: 42K3651; SUPPLIER: VISHAY DALE ELECTRONICS; TOLERANCE: ±1%; WATTAGE: 0.1 W
R70 = Vishay_By_element14_Batch_1:CRCW06038K66FKEA: RESISTOR, 0603; MPN: CRCW06038K66FKEA; OC_FARNELL: 1152136; OC_NEWARK: 52K8729; SUPPLIER: VISHAY DALE ELECTRONICS; TOLERANCE: ±1%; WATTAGE: 0.1 W
R71 R80 = Vishay_By_element14_Batch_1:CRCW060382K5FKEA: RESISTOR, 0603; MPN: CRCW060382K5FKEA; OC_FARNELL: 1469840; OC_NEWARK: 52K8737; SUPPLIER: Vishay; TOLERANCE: ± 1.0 %; WATTAGE: 0.1W
R72 R81 = Vishay_By_element14_Batch_1:CRCW0603453RFKEA: RESISTOR, 0603; MPN: CRCW0603453RFKEA; OC_FARNELL: 1364709; OC_NEWARK: 52K8540; SUPPLIER: VISHAY DALE ELECTRONICS; TOLERANCE: ±1%; WATTAGE: 0.1 W
R73 R82 = Vishay_By_element14_Batch_1:CRCW0603210KFKEA: RESISTOR, 0603; MPN: CRCW0603210KFKEA; OC_FARNELL: 1151823; OC_NEWARK: 52K8281; SUPPLIER: VISHAY DALE ELECTRONICS; TOLERANCE: ±1%; WATTAGE: 0.1 W
R74 = Vishay_By_element14_Batch_1:CRCW0603604RFKEA: RESISTOR, 0603; MPN: CRCW0603604RFKEA; OC_FARNELL: 1652895; OC_NEWARK: 52K8646; SUPPLIER: Vishay; TOLERANCE: ± 1.0 %; WATTAGE: 0.1W
R75 = Vishay_By_element14_Batch_1:CRCW0603392RFKEA: RESISTOR, 0603; MPN: CRCW0603392RFKEA; OC_FARNELL: 1354328; OC_NEWARK: 52K8482; SUPPLIER: VISHAY DALE ELECTRONICS; TOLERANCE: ±1%; WATTAGE: 0.1 W
R76 R77 = Vishay_By_element14_Batch_1:CRCW06036K04FKEA: RESISTOR, 0603; MPN: CRCW06036K04FKEA; OC_FARNELL: 1469829; OC_NEWARK: 52K8634; SUPPLIER: Vishay; TOLERANCE: ± 1.0 %; VALUE: 6.04K Ohms; WATTAGE: 0.1W
R79 = Vishay_By_element14_Batch_1:CRCW06038K66FKEA: RESISTOR, 0603; MPN: CRCW06038K66FKEA; OC_FARNELL: 1152136; OC_NEWARK: 52K8729; SUPPLIER: VISHAY DALE ELECTRONICS; TOLERANCE: ±1%; VALUE: 8.66K Ohms; WATTAGE: 0.1 W
R87 R88 R95 R96 = Vishay_By_element14_Batch_1:CRCW0603536RFKEA: RESISTOR, 0603; MPN: CRCW0603536RFKEA; OC_FARNELL: 1152068; OC_NEWARK: 52K8609; SUPPLIER: VISHAY DALE ELECTRONICS; TOLERANCE: ±1%; WATTAGE: 0.1 W
R99 R100 = Vishay_By_element14_Batch_1:CRCW06030000Z0EA: RESISTOR, 0603; MPN: CRCW06030000Z0EA; OC_FARNELL: 1469739; OC_NEWARK: 52K8014; SUPPLIER: Vishay; TOLERANCE: -; WATTAGE: 0.1W
RV1 RV3-RV7 = WE-VS:WE-VS: WESURGE SMD Varistor WE-VS - Fast response time - Low leakage current - Low clamping voltage - Wide range of voltage avaible - Almost no energy consumption in stand-by mode - Excellent absorption at surge-impulses - Nickel barrier for leadfree soldering - Operating temperature: -40°C to +85°C for size 0402 to 0805; -40°C to +1255°C for size 1206 to 2220 -- Protection of DC distribution -- Protection of power supply -- Protection of semiconductors -- Protection of bus systems and communication lines -- Limiting of over-voltage -- ESD protection in accordance with EN 61000-4-2 and Surge protection in accordance with EN 61000-4-5; MPN: 82536140; OC_FARNELL: 1636437; OC_NEWARK: 08P3014; PACKAGE: 0603; SUPPLIER: WURTH ELEKTRONIK
RV2 = WE-VS:WE-VS: WESURGE SMD Varistor WE-VS - Fast response time - Low leakage current - Low clamping voltage - Wide range of voltage avaible - Almost no energy consumption in stand-by mode - Excellent absorption at surge-impulses - Nickel barrier for leadfree soldering - Operating temperature: -40°C to +85°C for size 0402 to 0805; -40°C to +1255°C for size 1206 to 2220 -- Protection of DC distribution -- Protection of power supply -- Protection of semiconductors -- Protection of bus systems and communication lines -- Limiting of over-voltage -- ESD protection in accordance with EN 61000-4-2 and Surge protection in accordance with EN 61000-4-5; MPN: 82536040; OC_FARNELL: 1636434; OC_NEWARK: 08P3011; PACKAGE: 0603; SUPPLIER: WURTH ELEKTRONIK
S1 = strasys_standard:WS-TST-6X6: Tact Switch THT version; MNP: 431256031716; OC_FARNELL: 2065131; SUPPLIER: WE
U1-U3 = strasys_standard:VNI4140K: Quad high-side smart power solid-state relay,power SSO-24; MPN: VNI4140K; OC_FARNELL: 2309422; OC_NEWARK: 70W1089; PACKAGE: SO-24; SUPPLIER: STMICROELECTRONICS
U4 = Microchip-MCP7940N-I_SN:MCP7940N-I/SN: I2C™ Real-Time Clock/Calendar with SRAM,SOIC-8; MPN: MCP7940N-I/SN; OC_FARNELL: 2361122; OC_NEWARK: 26T2748; PACKAGE: SOIC-8; SUPPLIER: MICROCHIP
U5 = strasys_standard:PMEG2005ET: 500 mA low VF single MEGA Schottky barrier rectifier; MPN: PMEG2005ET; OC_FARNELL: 1510672; PACKAGE: SOT-23-3; SUPPLIER: NXP
U8 = strasys_standard:OPA2188AIDGKR: OP AMP, GP, RR, 2MHZ, 36-V, Zero-Drift,8MSOP; MPN: OPA2188AIDGKR; OC_FARNELL: 2057091; OC_NEWARK: 61T5955; PACKAGE: 8MSOP; SUPPLIER: TEXAS INSTRUMENTS
U9 = strasys_standard:OPA4170AIPW: OPERATIONAL AMPLIFIERS,TSSOP-14; MPN: OPA4170AIPW; OC_FARNELL: 2095843; OC_NEWARK: 91T5046; PACKAGE: TSSOP-14; SUPPLIER: TEXAS INSTRUMENTS
U$1-U$4 U$10-U$13 U$18-U$21 U$27-U$30 = strasys_standard:TCMT1106: OPTOKOPPLER 1-Kanal Optokoppler Gehäuse: SOP-4; MANUFACTURER: Vishay; MPN: TCMT1106; OC_FARNELL: 2251262; PACKAGE: SOP-4
U$5-U$8 U$14-U$17 U$22-U$26 U$31-U$34 = strasys_standard:KP-1608QBC-D-LED: KP-1608QBC-D-LED Chip LED SMD Package 0603 BLUE; MPC: KP-1608QBC-D-LED; OC_FARNELL: 2217972; SUPPLIER: Kingbright
U$9 = strasys_standard:SM15T: TVS - Diode SM15T series unidirectional; MPN: SM15T39A; OC_FARNELL: 9802606; PACKAGE: DO-214AB; SUPPLIER: STMICROELECTRONICS
U$35 = Microchip_By_element14_Batch_1:24AA256-I/SN: EEPROM; MPN: 24AA256-I/SN; OC_FARNELL: 1331295; OC_NEWARK: 92C6874; PACKAGE: SOIC-8; SUPPLIER: MICROCHIP
U$36 = strasys_standard:ABS10: Crystal Frequency: 32.768 kHz Capacitance: 7pF; MPN: ABS10-32.768KHZ-7-T; OC_FARNELL: 2101351; SUPPLIER: ABRACON
U$37 = strasys_standard:BATTERY_COIN_CLIP: Battery Coin Holder 16mm For 16 mm battery coins; MPN: 3013; OC_FARNELL: 1650698; PACKAGE: 16mm; SUPPLIER: Keystone
U$38 = strasys_standard:HD-20: SUB-D 9 female (=Buchse); MNC: 1734354-1; OC_FARNELL: 1653978; SUPPLIER: TE-Connectivity
X1 = con-weidmueller-sl35:90F-2: WEIDMUELLER CLAMP CONNECTOR; OC_FARNELL: unknown; OC_NEWARK: unknown
X2 = con-weidmueller-sl35:90G-16: WEIDMUELLER CLAMP CONNECTOR; OC_FARNELL: unknown; OC_NEWARK: unknown
X3 = strasys_standard:S2L3.50/10/90G: OMNIMATE S2L3.50/10/90G Fa. Weidmüller
X4 = strasys_standard:314-020-014-00; MPN: 314-020-014-00; SUPPLIER: W+P